# Altium project High power brushded DC MC.PrjPcb
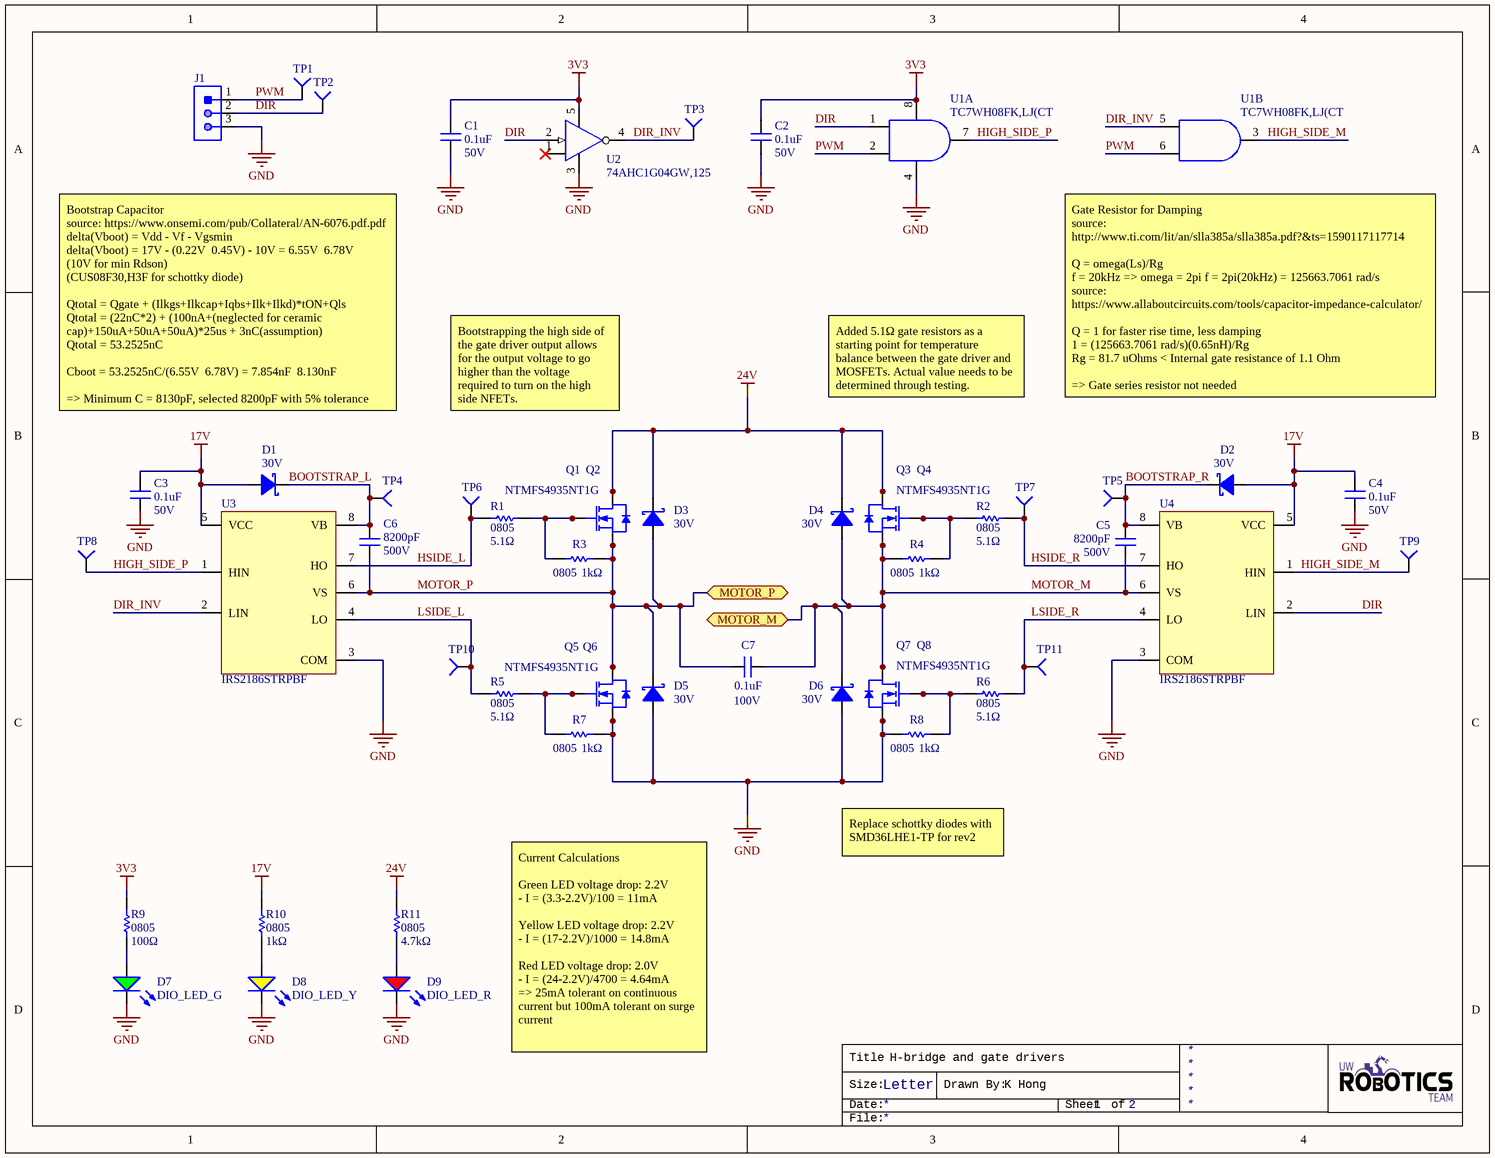
[diagram p0: H-bridge and gate drivers.SchDoc]
2 sheets, 81 parts. Net scope: flat (ports and power ports of the same name join across sheets).
Board file: High power brushded DC MC.PcbDoc
Sheets:
  H-bridge and gate drivers.SchDoc
  Connectors and PDB.SchDoc

## Sheet H-bridge and gate drivers.SchDoc: H-bridge and gate drivers
size Letter; DrawnBy: K Hong; SheetNumber: 1; SheetTotal: 2

### Parts
C1  value 0.1uF  Voltage Rating: 50V  [CAPC2012X140N]  (hidden comment: CAP_0.1uF_50V_0805)
C2  value 0.1uF  Voltage Rating: 50V  [CAPC2012X140N]  (hidden comment: CAP_0.1uF_50V_0805)
C3  value 0.1uF  Voltage Rating: 50V  [CAPC2012X140N]  (hidden comment: CAP_0.1uF_50V_0805)
C4  value 0.1uF  Voltage Rating: 50V  [CAPC2012X140N]  (hidden comment: CAP_0.1uF_50V_0805)
C5  Capacitance: 8200pF  Voltage Rating (DC): 500V  [CAPC1206(3216)]  (hidden comment: CAP_8200pF_500V_1206)
C6  Capacitance: 8200pF  Voltage Rating (DC): 500V  [CAPC1206(3216)]  (hidden comment: CAP_8200pF_500V_1206)
C7  Capacitance: 0.1uF  Voltage(DC): 100V  [MKS2D031001A00MSSD]  (hidden comment: CAP_0.1uF_100V_FILM)
D1  Vr (Max): 30V  [SOD-323_UNIDIR]  (hidden comment: DIO_SCHOTTKY_30V_800mA)
D2  Vr (Max): 30V  [SOD-323_UNIDIR]  (hidden comment: DIO_SCHOTTKY_30V_800mA)
D3  Vr (Max): 30V  [SOD-323_UNIDIR]  (hidden comment: DIO_SCHOTTKY_30V_800mA)
D4  Vr (Max): 30V  [SOD-323_UNIDIR]  (hidden comment: DIO_SCHOTTKY_30V_800mA)
D5  Vr (Max): 30V  [SOD-323_UNIDIR]  (hidden comment: DIO_SCHOTTKY_30V_800mA)
D6  Vr (Max): 30V  [SOD-323_UNIDIR]  (hidden comment: DIO_SCHOTTKY_30V_800mA)
D7  DIO_LED_G  [LED_0805_LINE]
D8  DIO_LED_Y  [LED_0805_LINE]
D9  DIO_LED_R  [LED_0805_LINE]
J1  CON_3M_TERM  [1935174]  (value not drawn)
Q1  NTMFS4935NT1G  [SO8-FL]  (value not drawn)
Q2  NTMFS4935NT1G  [SO8-FL]
Q3  NTMFS4935NT1G  [SO8-FL]
Q4  NTMFS4935NT1G  [SO8-FL]  (value not drawn)
Q5  NTMFS4935NT1G  [SO8-FL]  (value not drawn)
Q6  NTMFS4935NT1G  [SO8-FL]
Q7  NTMFS4935NT1G  [SO8-FL]  (value not drawn)
Q8  NTMFS4935NT1G  [SO8-FL]
R1  value 5.1Ω  Case Code (Imperial): 0805  [RESC2013X70X40LL20T20]  (hidden comment: RES_5.1Ω_0805)
R2  value 5.1Ω  Case Code (Imperial): 0805  [RESC2013X70X40LL20T20]  (hidden comment: RES_5.1Ω_0805)
R3  value 1kΩ  Case Code (Imperial): 0805  [RESC2012X60N]  (hidden comment: RES_1kΩ_0805)
R4  value 1kΩ  Case Code (Imperial): 0805  [RESC2012X60N]  (hidden comment: RES_1kΩ_0805)
R5  value 5.1Ω  Case Code (Imperial): 0805  [RESC2013X70X40LL20T20]  (hidden comment: RES_5.1Ω_0805)
R6  value 5.1Ω  Case Code (Imperial): 0805  [RESC2013X70X40LL20T20]  (hidden comment: RES_5.1Ω_0805)
R7  value 1kΩ  Case Code (Imperial): 0805  [RESC2012X60N]  (hidden comment: RES_1kΩ_0805)
R8  value 1kΩ  Case Code (Imperial): 0805  [RESC2012X60N]  (hidden comment: RES_1kΩ_0805)
R9  value 100Ω  Case Code (Imperial): 0805  [RESC2012X60N]  (hidden comment: RES_100Ω_0805)
R10  value 1kΩ  Case Code (Imperial): 0805  [RESC2012X60N]  (hidden comment: RES_1kΩ_0805)
R11  value 4.7kΩ  Case Code (Imperial): 0805  [RESC2012X60N]  (hidden comment: RES_4.7kΩ_0805)
TP1  TESTPOINT_SMD  [TESTPOINT]  (value not drawn)
TP2  TESTPOINT_SMD  [TESTPOINT]  (value not drawn)
TP3  TESTPOINT_SMD  [TESTPOINT]  (value not drawn)
TP4  TESTPOINT_SMD  [TESTPOINT]  (value not drawn)
TP5  TESTPOINT_SMD  [TESTPOINT]  (value not drawn)
TP6  TESTPOINT_SMD  [TESTPOINT]  (value not drawn)
TP7  TESTPOINT_SMD  [TESTPOINT]  (value not drawn)
TP8  TESTPOINT_SMD  [TESTPOINT]  (value not drawn)
TP9  TESTPOINT_SMD  [TESTPOINT]  (value not drawn)
TP10  TESTPOINT_SMD  [TESTPOINT]  (value not drawn)
TP11  TESTPOINT_SMD  [TESTPOINT]  (value not drawn)
U1  TC7WH08FK,LJ(CT  [8-VFSOP]  (parts A,B of 2)
U2  74AHC1G04GW,125  [SOT353]
U3  IRS2186STRPBF  [8-SOIC_M]
U4  IRS2186STRPBF  [8-SOIC_M]

### Ports
MOTOR_M (bidir), MOTOR_P (bidir)

### Nets
3V3: C1.2 C2.2 R9.2 U1.8(Vcc) U2.5(Vcc)
17V: C3.2 C4.2 D1.1(Anode) D2.1(Anode) R10.2 U3.5(VCC) U4.5(VCC)
24V: D3.2(Cathode) D4.2(Cathode) Q1.3(Drain) Q2.3(Drain) Q3.3(Drain) Q4.3(Drain) R11.2
GND: C1.1 C2.1 C3.1 C4.1 D5.1(Anode) D6.1(Anode) D7.2(K) D8.2(K) D9.2(K) J1.3 Q5.1(Source) Q6.1(Source) Q7.1(Source) Q8.1(Source) R7.2 R8.1 U1.4(GND) U2.3(GND) U3.3(COM) U4.3(COM)
BOOTSTRAP_L: C6.2 D1.2(Cathode) TP4.1(=value) U3.8(VB)
BOOTSTRAP_R: C5.2 D2.2(Cathode) TP5.1(=value) U4.8(VB)
DIR: J1.2 TP2.1(=value) U1.1(A1) U2.2(A) U4.2(LIN)
DIR_INV: TP3.1(=value) U1.5(A2) U2.4(Y) U3.2(LIN)
HIGH_SIDE_M: TP9.1(=value) U1.3(Y2) U4.1(HIN)
HIGH_SIDE_P: TP8.1(=value) U1.7(Y1) U3.1(HIN)
HSIDE_L: R1.1 TP6.1(=value) U3.7(HO)
HSIDE_R: R2.2 TP7.1(=value) U4.7(HO)
LSIDE_L: R5.1 TP10.1(=value) U3.4(LO)
LSIDE_R: R6.2 TP11.1(=value) U4.4(LO)
MOTOR_M: C5.1 C7.2 D4.1(Anode) D6.2(Cathode) Q3.1(Source) Q4.1(Source) Q7.3(Drain) Q8.3(Drain) R4.1 U4.6(VS) ; port MOTOR_M
MOTOR_P: C6.1 C7.1 D3.1(Anode) D5.2(Cathode) Q1.1(Source) Q2.1(Source) Q5.3(Drain) Q6.3(Drain) R3.2 U3.6(VS) ; port MOTOR_P
PWM: J1.1 TP1.1(=value) U1.2(B1) U1.6(B2)
NetD7_1: D7.1(A) R9.1
NetD8_1: D8.1(A) R10.1
NetD9_1: D9.1(A) R11.1
NetQ1_2: Q1.2(Gate) Q2.2(Gate) R1.2 R3.1
NetQ3_2: Q3.2(Gate) Q4.2(Gate) R2.1 R4.2
NetQ5_2: Q5.2(Gate) Q6.2(Gate) R5.2 R7.1
NetQ7_2: Q7.2(Gate) Q8.2(Gate) R6.1 R8.2

Not connected (* = marked no-connect by the designer): U2 1(NC)*

### Notes on the sheet
- Bootstrap Capacitor
  source: https://www.onsemi.com/pub/Collateral/AN-6076.pdf.pdf
  delta(Vboot) = Vdd - Vf - Vgsmin
  delta(Vboot) = 17V - (0.22V  0.45V) - 10V = 6.55V  6.78V
  (10V for min Rdson)
  (CUS08F30,H3F for schottky diode)
  Qtotal = Qgate + (Ilkgs+Ilkcap+Iqbs+Ilk+Ilkd)*tON+Qls
  Qtotal = (22nC*2) + (100nA+(neglected for ceramic cap)+150uA+50uA+50uA)*25us + 3nC(assumption)
  Qtotal = 53.2525nC
  Cboot = 53.2525nC/(6.55V  6.78V) = 7.854nF  8.130nF
  => Minimum C = 8130pF, selected 8200pF with 5% tolerance
- Bootstrapping the high side of the gate driver output allows for the output voltage to go higher than the voltage required to turn on the high side NFETs.
- Added 5.1Ω gate resistors as a starting point for temperature balance between the gate driver and MOSFETs. Actual value needs to be determined through testing.
- (near U1) Gate Resistor for Damping
  source: http://www.ti.com/lit/an/slla385a/slla385a.pdf?&ts=1590117117714
  Q = omega(Ls)/Rg
  f = 20kHz => omega = 2pi f = 2pi(20kHz) = 125663.7061 rad/s
  source: https://www.allaboutcircuits.com/tools/capacitor-impedance-calculator/
  Q = 1 for faster rise time, less damping
  1 = (125663.7061 rad/s)(0.65nH)/Rg
  Rg = 81.7 uOhms < Internal gate resistance of 1.1 Ohm
  => Gate series resistor not needed
- Replace schottky diodes with SMD36LHE1-TP for rev2
- Current Calculations
  Green LED voltage drop: 2.2V
  - I = (3.3-2.2V)/100 = 11mA
  Yellow LED voltage drop: 2.2V
  - I = (17-2.2V)/1000 = 14.8mA
  Red LED voltage drop: 2.0V
  - I = (24-2.2V)/4700 = 4.64mA
  => 25mA tolerant on continuous current but 100mA tolerant on surge current
- Title
- Size:
- Date:
- Letter
- Drawn By:
- Sheet
- of
- File:

### Library data of the parts
C1-C4 = CAP_0.1uF_50V_0805: CAP CER 0.1UF 50V X7R 0805; Manufacturer 1: Murata Electronics; Manufacturer Part Number 1: GCD21BR71H104KA01L; Capacitance: 100nF; Tolerance: 10%; Mount: Surface Mount; Case/Package: 0805; Case Code (Metric): 2012; Case Code (Imperial): 0805; Min Operating Temperature: -55°C; Max Operating Temperature: 125°C; Dielectric: X7R; Termination: SMD/SMT; Length: 2mm; Height: 1.25mm; Width: 0.049inch; Thickness: 0.049inch; Depth: 1.25mm; Ratings: AEC-Q200; ComponentLink1URL: https://datasheet.ciiva.com/29537/c03e-29537701.pdf?src-supplier=Digi-Key; ComponentLink1Description: https://datasheet.ciiva.com/29537/c03e-29537701.pdf?src-supplier=Digi-Key; Supplier 1: Digi-Key; Supplier Part Number 1: 490-11955-1-ND
C5 C6 = CAP_8200pF_500V_1206: Cap 0.0082uF 500Vdc C0G 5% SMD 1206 125°C Paper T/R; Manufacturer 1: KEMET; Manufacturer Part Number 1: C1206C822JCGACAUTO; Supplier 1: Digi-Key; RoHS: No; Category: Ceramic Capacitors; Stock 1: 2611; Pricing 1: 1=0.45000, 10=0.31800, 100=0.20960, 500=0.15528, 1000=0.13198 (USD); Tolerance: 5%; ComponentLink1URL: https://datasheet.ciiva.com:443/pdfs/VipMasterIC/IC/KEME/KEME-S-A0008958438/KEME-S-A0008958438-1.pdf?src-supplier=IHS+Markit; ComponentLink1Description: https://datasheet.ciiva.com:443/pdfs/VipMasterIC/IC/KEME/KEME-S-A0008958438/KEME-S-A0008958438-1.pdf?src-supplier=IHS+Markit; Supplier Part Number 1: 399-14847-1-ND; ComponentLink2URL: http://www.farnell.com/datasheets/2746514.pdf?src-supplier=Farnell; ComponentLink2Description: http://www.farnell.com/datasheets/2746514.pdf?src-supplier=Farnell; ComponentLink3URL: http://www.farnell.com/datasheets/2746514.pdf?src-supplier=Newark; ComponentLink3Description: http://www.farnell.com/datasheets/2746514.pdf?src-supplier=Newark; Package: 1206
C7 = CAP_0.1uF_100V_FILM: CAP FILM 0.1UF 100V RADIAL; Manufacturer 1: WIMA; Tolerance: 20%; Dielectric: PET; Lead Diameter: 0.5mm; Voltage(AC): 63V; Case/Package: Radial; Min Operating Temperature: -55°C; Max Operating Temperature: 100°C; Length: 7.2mm; Depth: 2.5mm; ComponentLink1URL: https://datasheet.ciiva.com:443/pdfs/VipMasterIC/IC/WIMA/WIMA-S-A0007419204/WIMA-S-A0007419204-1.pdf?src-supplier=IHS+Markit; ComponentLink1Description: https://datasheet.ciiva.com:443/pdfs/VipMasterIC/IC/WIMA/WIMA-S-A0007419204/WIMA-S-A0007419204-1.pdf?src-supplier=IHS+Markit; Supplier 1: Digi-Key; Supplier Part Number 1: 1928-1656-ND; Manufacturer Part Number 1: MKS2D031001A00MSSD; RoHS: Yes; Category: Film Capacitors; Stock 1: 4135; Pricing 1: 1=0.43000, 10=0.30000, 100=0.17970, 500=0.13478, 1000=0.11381, 2500=0.10782, 5000=0.10183 (USD); Packaging: Bulk; Lead Pitch: 5mm; Radiation Hardening: No; ComponentLink2URL: https://datasheet.ciiva.com/26863/getdatasheetpartid-403283-26863662.pdf?src-supplier=Verical; ComponentLink2Description: https://datasheet.ciiva.com/26863/getdatasheetpartid-403283-26863662.pdf?src-supplier=Verical
D1-D6 = DIO_SCHOTTKY_30V_800mA: DIODE SCHOTTKY 30V 800MA USC; Manufacturer 1: Toshiba Semiconductor and Storage; Manufacturer Part Number 1: CUS08F30,H3F; Vf (Max): 220mV; Supplier 1: Digi-Key; Supplier Part Number 1: CUS08F30H3FCT-ND; Mount: Surface Mount; Io: 800mA
D7 = DIO_LED_G: LED GREEN DIFFUSED 0805 SMD; Manufacturer Part Number 1: LG R971-KN-1; Manufacturer 1: OSRAM; Forward Voltage Drop: 2.2V; Package: 0805 (2012 Metric); Supplier Part Number 1: 475-1410-1-ND; Supplier 1: Digi-Key; Mount: Surface Mount
D8 = DIO_LED_Y: LED YELLOW DIFFUSED 0805 SMD; Manufacturer Part Number 1: LY R976-PS-36; Manufacturer 1: OSRAM; Forward Voltage Drop: 2.2V; Package: 0805 (2012 Metric); Supplier Part Number 1: 475-2560-1-ND; Supplier 1: Digi-Key; Mount: Surface Mount
D9 = DIO_LED_R: LED RED DIFFUSED 0805 SMD; Manufacturer Part Number 1: LS R976-NR-1; Manufacturer 1: OSRAM; Forward Voltage Drop: 2V; Package: 0805 (2012 Metric); Supplier Part Number 1: 475-1278-1-ND; Supplier 1: Digi-Key; Mount: Surface Mount
J1 = CON_3M_TERM: TERM BLK 3POS SIDE ENTRY 5MM; Manufacturer 1: Phoenix Contact; Number of Contacts: 3; Voltage Rating (DC): 320V; Number of Levels: 1; Current: 18A; Voltage: 300V; Max Current Rating: 16A; Voltage Rating: 250V; Current Rating: 17.5A; Wire Gauge (Max): 26AWG; Wire Gauge (Min): 12AWG; Approvals: UL,VDE,CB; Supplier 1: Digi-Key; Supplier Part Number 1: 277-1578-ND; Manufacturer Part Number 1: 1935174; Mount: Through Hole; RoHS: Yes; Category: Terminal Blocks; Stock 1: 25144; Pricing 1: 1=0.60000, 10=0.58000, 50=0.55440, 100=0.53930, 250=0.50400, 500=0.46368, 1000=0.42840, 2500=0.42838 (USD); Number of Pins: 3; Weight: 0.100531oz; Contact Material: Copper,Tin; Color: Green; Insulation Material: Nylon; Housing Material: Polyamide; Material: Nylon; Housing Color: Green; Termination: Solder; Packaging: Bulk; Orientation: Straight; Number of Positions Per Level: 3; Number of Positions: 3; Number of Circuits: 3; Package Quantity: 250; Number of Poles: 3; Number of Rows: 1; Max Supply Voltage: 250V; Length: 9mm; Height: 11.3mm; Pitch: 5mm; Depth: 9mm; Stripping Length: 5mm; Width: 15mm; Wire/Cable Gauge: 26AWG; Radiation Hardening: No; REACH SVHC: Unknown; Flammability Rating: UL94 V-0; Lead Free: Lead Free; ComponentLink1URL: https://datasheet.ciiva.com:443/pdfs/VipMasterIC/IC/PCON/PCON-S-A0007661889/PCON-S-A0008047997-1.pdf?src-supplier=IHS+Markit; ComponentLink1Description: https://datasheet.ciiva.com:443/pdfs/VipMasterIC/IC/PCON/PCON-S-A0007661889/PCON-S-A0008047997-1.pdf?src-supplier=IHS+Markit; ComponentLink2URL: https://datasheet.ciiva.com/16047/1935174-16047249.pdf?src-supplier=Onlinecomponents.com; ComponentLink2Description: https://datasheet.ciiva.com/16047/1935174-16047249.pdf?src-supplier=Onlinecomponents.com; ComponentLink3URL: https://datasheet.ciiva.com/15169/getdatasheetpartid-212213-15169949.pdf?src-supplier=Verical; ComponentLink3Description: https://datasheet.ciiva.com/15169/getdatasheetpartid-212213-15169949.pdf?src-supplier=Verical; ComponentLink4URL: https://datasheet.ciiva.com/823/combiconcompact5-0mmseries-823761.pdf?src-supplier=Digi-Key; ComponentLink4Description: https://datasheet.ciiva.com/823/combiconcompact5-0mmseries-823761.pdf?src-supplier=Digi-Key; ComponentLink5URL: https://datasheet.ciiva.com/29218/744167-da-01-en-printklemme-pt-1-5-3-5-0-h-29218252.pdf?src-supplier=Conrad; ComponentLink5Description: https://datasheet.ciiva.com/29218/744167-da-01-en-printklemme-pt-1-5-3-5-0-h-29218252.pdf?src-supplier=Conrad
Q1-Q8 = NTMFS4935NT1G: MOSFET N-CH 30V 13A SO8FL; Manufacturer 1: ON Semiconductor; Continuous Drain Current (ID): 93A; Drain to Source Resistance: 3.2mR; Power Dissipation: 2.63W; Max Power Dissipation: 48W; Threshold Voltage: 1.63V; Turn-On Delay Time: 16.3ns; Turn-Off Delay Time: 27.5ns; Fall Time: 6.6ns; Number of Elements: 1; Input Capacitance: 4.85nF; Rise Time: 20ns; Element Configuration: Single; Gate to Source Voltage (Vgs): 20V; Supplier 1: Digi-Key; RoHS: Yes; Category: MOSFETs; Stock 1: 10192; Pricing 1: 1=0.87000, 10=0.76800, 25=0.72160, 100=0.52380, 250=0.50516, 500=0.43766 (USD); Case/Package: SO; Number of Pins: 5; Contact Plating: Tin,Matte; Min Operating Temperature: -55°C; Max Operating Temperature: 150°C; Drain to Source Breakdown Voltage: 30V; Drain to Source Voltage (Vdss): 30V; Nominal Vgs: 1.63V; Package Quantity: 1; Rds On Max: 3.2mR; Packaging: Tape and Reel; Length: 5.1mm; Height: 1.1mm; Width: 6.1mm; Radiation Hardening: No; Lead Free: Lead Free; REACH SVHC: No SVHC; ComponentLink1URL: https://datasheet.ciiva.com:443/pdfs/VipMasterIC/IC/ONSM/ONSM-S-A0008367025/ONSM-S-A0008367025-1.pdf?src-supplier=IHS+Markit; ComponentLink1Description: https://datasheet.ciiva.com:443/pdfs/VipMasterIC/IC/ONSM/ONSM-S-A0008367025/ONSM-S-A0008367025-1.pdf?src-supplier=IHS+Markit; ComponentLink2URL: https://datasheet.ciiva.com/22641/1707323-22641681.pdf?src-supplier=Element14; ComponentLink2Description: https://datasheet.ciiva.com/22641/1707323-22641681.pdf?src-supplier=Element14; ComponentLink3URL: https://datasheet.ciiva.com/947/ntmfs4935n-d-947308.pdf?src-supplier=Digi-Key; ComponentLink3Description: https://datasheet.ciiva.com/947/ntmfs4935n-d-947308.pdf?src-supplier=Digi-Key; ComponentLink4URL: https://datasheet.ciiva.com/11166/ntmfs4935n-d-11166461.pdf?src-supplier=Avnet; ComponentLink4Description: https://datasheet.ciiva.com/11166/ntmfs4935n-d-11166461.pdf?src-supplier=Avnet; ComponentLink5URL: https://datasheet.ciiva.com/947/ntmfs4935n-d-947310.pdf?src-supplier=Digi-Key; ComponentLink5Description: https://datasheet.ciiva.com/947/ntmfs4935n-d-947310.pdf?src-supplier=Digi-Key; ComponentLink6URL: https://datasheet.ciiva.com/947/ntmfs4935n-d-947309.pdf?src-supplier=Digi-Key; ComponentLink6Description: https://datasheet.ciiva.com/947/ntmfs4935n-d-947309.pdf?src-supplier=Digi-Key; Supplier Part Number 1: NTMFS4935NT1GOSCT-ND
  Q2 Q3 Q6 Q8: Manufacturer Part Number 1: NTMFS4935NT1G
R1 R2 R5 R6 = RES_5.1Ω_0805: RES SMD 5.1 OHM 5% 1/8W 0805; Manufacturer 1: Panasonic; Manufacturer Part Number 1: ERJ-6GEYJ5R1V; Supplier 1: Digi-Key; Supplier Part Number 1: P5.1ACT-ND; Mount: Surface Mount; Case Code (Metric): 2012
R3 R4 R7 R8 R10 = RES_1kΩ_0805: RES SMD 1K OHM 1% 1/8W 0805; Manufacturer 1: Yageo; Manufacturer Part Number 1: RC0805FR-071KL; Power Rating: 125mW; Supplier 1: Digi-Key; Case Code (Metric): 2012; Min Operating Temperature: -55°C; Max Operating Temperature: 155°C; Resistance: 1K; Tolerance: 1%; Termination: SMD/SMT; Supplier Part Number 1: 311-1.00KCRCT-ND
R9 = RES_100Ω_0805: RES SMD 100 OHM 1% 1/8W 0805; Manufacturer 1: Yageo; Manufacturer Part Number 1: RC0805FR-07100RL; Power Rating: 125mW; Supplier 1: Digi-Key; Mount: Surface Mount; Case Code (Metric): 2012; Supplier Part Number 1: 311-100CRCT-ND
R11 = RES_4.7kΩ_0805: RES SMD 4.7K OHM 5% 1/8W 0805; Manufacturer 1: Yageo; Manufacturer Part Number 1: RC0805JR-074K7L; Resistance: 4.7kR; Power Rating: 125mW; Temperature Coefficient: 100ppm/°C; Voltage Rating: 150V; Supplier 1: Digi-Key; Case Code (Metric): 2012; Min Operating Temperature: -55°C; Max Operating Temperature: 155°C; Tolerance: 5%; Termination: SMD/SMT; Supplier Part Number 1: 311-4.7KARCT-ND; Stock 1: 2755291; Pricing 1: 1=0.10000, 10=0.03500, 100=0.01400, 1000=0.00631, 2500=0.00548 (USD); RoHS: Yes; Case/Package: Molded; Contact Plating: Tin,Lead,Matte; Packaging: Tape and Reel; Composition: Thick Film; Military Standard: Not; Length: 2mm; Depth: 1.25mm; Radiation Hardening: No; REACH SVHC: Unknown; Lead Free: Lead Free; ComponentLink1URL: https://datasheet.ciiva.com/7941/442941-7941973.pdf?src-supplier=Element14; ComponentLink1Description: https://datasheet.ciiva.com/7941/442941-7941973.pdf?src-supplier=Element14; ComponentLink2URL: https://datasheet.ciiva.com/7941/442941-7941974.pdf?src-supplier=Element14; ComponentLink2Description: https://datasheet.ciiva.com/7941/442941-7941974.pdf?src-supplier=Element14; ComponentLink3URL: https://datasheet.ciiva.com/17486/rc0805-17486827.pdf?src-supplier=Future+Electronics; ComponentLink3Description: https://datasheet.ciiva.com/17486/rc0805-17486827.pdf?src-supplier=Future+Electronics; ComponentLink4URL: https://datasheet.ciiva.com/12667/rc0805-12667037.pdf?src-supplier=Mouser; ComponentLink4Description: https://datasheet.ciiva.com/12667/rc0805-12667037.pdf?src-supplier=Mouser; Mount: Surface Mount
U1 = TC7WH08FK,LJ(CT: AND Gate 2-Element 2-IN CMOS Automotive 8-Pin SSOP T/R; Manufacturer 1: Toshiba; Number of Circuits: 2; Quiescent Current: 2uA; High Level Output Current: 8mA; Propagation Delay: 7.9ns; Supplier 1: Digi-Key; RoHS: Yes; Category: Logic Gates; Stock 1: 703; Pricing 1: 1=0.41000, 10=0.30500, 25=0.27520, 100=0.19000, 250=0.16000, 500=0.13000, 1000=0.10000 (USD); Mount: Surface Mount; Number of Pins: 8; Min Operating Temperature: -40°C; Max Operating Temperature: 85°C; Logic Function: AND; Packaging: Tape and Reel; Number of Inputs: 2; Low Level Output Current: 8mA; ComponentLink1URL: https://datasheet.ciiva.com:443/pdfs/VipMasterIC/IC/TOSC/TOSC-S-A0002811544/TOSC-S-A0002811544-1.pdf?src-supplier=IHS+Markit; ComponentLink1Description: https://datasheet.ciiva.com:443/pdfs/VipMasterIC/IC/TOSC/TOSC-S-A0002811544/TOSC-S-A0002811544-1.pdf?src-supplier=IHS+Markit; ComponentLink2URL: http://www.mouser.com/ds/2/408/TC7WH08FU_datasheet_en_20170424-1144181.pdf?src-supplier=Mouser; ComponentLink2Description: http://www.mouser.com/ds/2/408/TC7WH08FU_datasheet_en_20170424-1144181.pdf?src-supplier=Mouser; ComponentLink3URL: https://toshiba.semicon-storage.com/info/docget.jsp?did=20117&prodName=TC7WH08FU&src-supplier=Digi-Key; ComponentLink3Description: https://toshiba.semicon-storage.com/info/docget.jsp?did=20117&prodName=TC7WH08FU&src-supplier=Digi-Key; Supplier Part Number 1: TC7WH08FKLJ(CTCT-ND; Manufacturer Part Number 1: TC7WH08FK,LJ(CT
U2 = 74AHC1G04GW,125: 74AHC Series 5 V High Speed Si-Gate CMOS Inverter Buffer Surface Mount - TSSOP-5; Manufacturer 1: Nexperia; Supplier 1: Digi-Key; RoHS: No; Stock 1: 10022; Pricing 1: 1=0.21000, 10=0.17400, 25=0.14600, 100=0.09230, 250=0.07128, 500=0.06076, 1000=0.04131 (USD); ComponentLink1URL: https://datasheet.ciiva.com:443/pdfs/VipMasterIC/IC/NEXP/NEXP-S-A0003105567/NEXP-S-A0003105477-1.pdf?src-supplier=IHS+Markit; ComponentLink1Description: https://datasheet.ciiva.com:443/pdfs/VipMasterIC/IC/NEXP/NEXP-S-A0003105567/NEXP-S-A0003105477-1.pdf?src-supplier=IHS+Markit; Supplier Part Number 1: 1727-3147-1-ND; Manufacturer Part Number 1: 74AHC1G04GW,125
U3 U4 = IRS2186STRPBF: IC DRIVER HI/LO SIDE 600V 8-SOIC; Manufacturer 1: International Rectifier; Max Supply Current: 240uA; Number of Outputs: 2; Max Supply Voltage: 20V; Min Supply Voltage: 10V; Max Power Dissipation: 625mW; Fall Time: 30ns; Turn-Off Delay Time: 170ns; Rise Time: 38ns; Propagation Delay: 250ns; Max Output Current: 4A; Supplier 1: Digi-Key; RoHS: Yes; Category: Gate Drivers; Stock 1: 2450; Pricing 1: 1=1.50000, 10=1.35000, 25=1.27400, 100=1.01920, 250=0.89180, 500=0.86632, 1000=0.68796 (USD); Mount: Surface Mount; Case/Package: SOIC; Number of Pins: 8; Min Operating Temperature: -40°C; Max Operating Temperature: 125°C; Number of Drivers: 2; Turn-On Delay Time: 170ns; Power Dissipation: 625mW; Package Quantity: 1; Packaging: Tape and Reel; Output Current: 4A; Nominal Supply Current: 240uA; Radiation Hardening: No; Lead Free: Lead Free; ComponentLink1URL: https://datasheet.ciiva.com:443/pdfs/VipMasterIC/IC/IRSD/IRSD-S-A0000774532/IRSD-S-A0000774532-1.pdf?src-supplier=IHS+Markit; ComponentLink1Description: https://datasheet.ciiva.com:443/pdfs/VipMasterIC/IC/IRSD/IRSD-S-A0000774532/IRSD-S-A0000774532-1.pdf?src-supplier=IHS+Markit; ComponentLink2URL: https://datasheet.ciiva.com/1952/irs2186pbf-1952608.pdf?src-supplier=Digi-Key; ComponentLink2Description: https://datasheet.ciiva.com/1952/irs2186pbf-1952608.pdf?src-supplier=Digi-Key; ComponentLink3URL: https://datasheet.ciiva.com/16442/irs2186pbf-16442422.pdf?src-supplier=Future+Electronics; ComponentLink3Description: https://datasheet.ciiva.com/16442/irs2186pbf-16442422.pdf?src-supplier=Future+Electronics; ComponentLink4URL: https://datasheet.ciiva.com/1952/irs2186pbf-1952607.pdf?src-supplier=Digi-Key; ComponentLink4Description: https://datasheet.ciiva.com/1952/irs2186pbf-1952607.pdf?src-supplier=Digi-Key; Supplier Part Number 1: IRS2186STRPBFCT-ND; Manufacturer Part Number 1: IRS2186STRPBF
TP1-TP11 = TESTPOINT_SMD: Part Number (MPN): *

## Sheet Connectors and PDB.SchDoc: Connectors and PDB
size Letter; DrawnBy: Kyle Hong; SheetNumber: 2; SheetTotal: 2
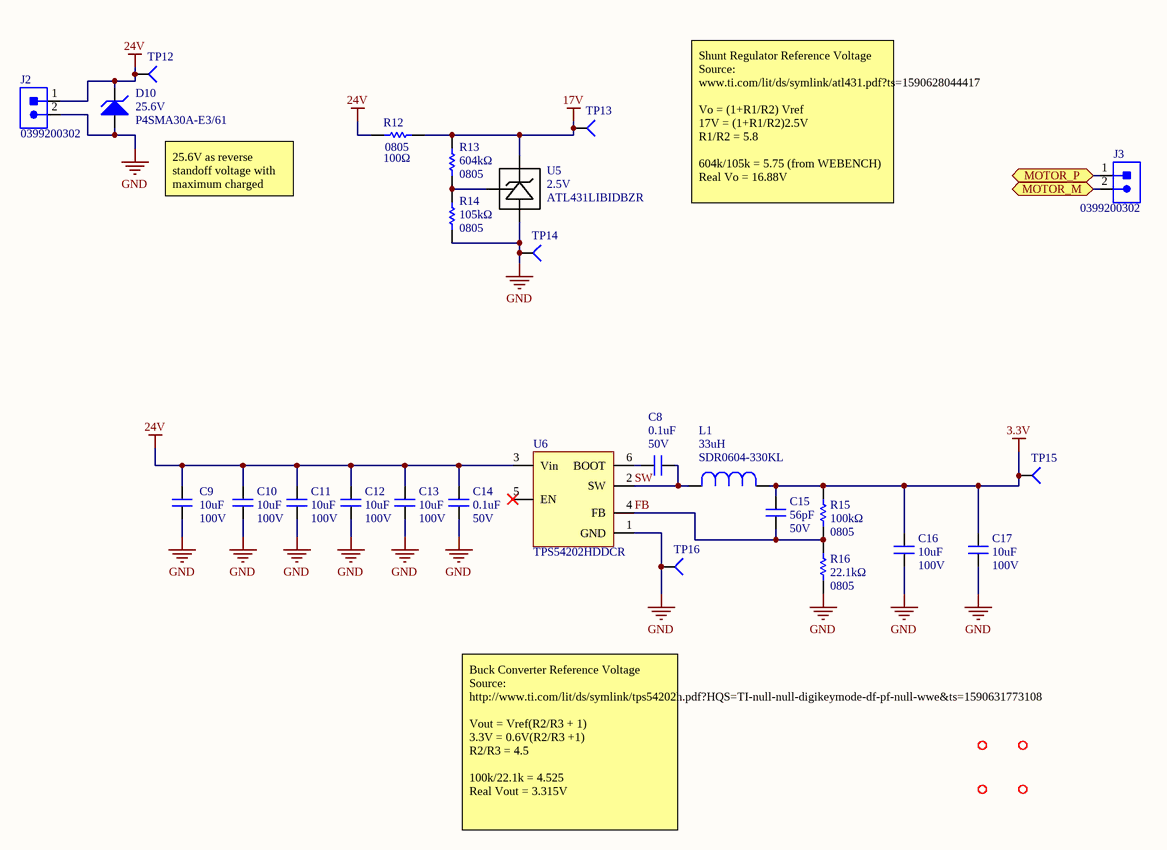
[diagram p1: Connectors and PDB.SchDoc]

### Parts
C8  value 0.1uF  Voltage Rating: 50V  [CAPC2012X140N]  (hidden comment: CAP_0.1uF_50V_0805)
C9  Capacitance: 10uF  Voltage Rating: 100V  [CAPC1210(3225)]  (hidden comment: CAP_10uF_100V_1210)
C10  Capacitance: 10uF  Voltage Rating: 100V  [CAPC1210(3225)]  (hidden comment: CAP_10uF_100V_1210)
C11  Capacitance: 10uF  Voltage Rating: 100V  [CAPC1210(3225)]  (hidden comment: CAP_10uF_100V_1210)
C12  Voltage Rating: 100V  Capacitance: 10uF  [CAPC1210(3225)]  (hidden comment: CAP_10uF_100V_1210)
C13  Voltage Rating: 100V  Capacitance: 10uF  [CAPC1210(3225)]  (hidden comment: CAP_10uF_100V_1210)
C14  value 0.1uF  Voltage Rating: 50V  [CAPC2012X140N]  (hidden comment: CAP_0.1uF_50V_0805)
C15  Voltage Rating: 50V  Capacitance: 56pF  [CAP 0805_2012]  (hidden comment: CAP_56pF_50V_0805)
C16  Capacitance: 10uF  Voltage Rating: 100V  [CAPC1210(3225)]  (hidden comment: CAP_10uF_100V_1210)
C17  Capacitance: 10uF  Voltage Rating: 100V  [CAPC1210(3225)]  (hidden comment: CAP_10uF_100V_1210)
D10  Reverse Standoff Voltage: 25.6V  [DO-214AC_UNI]  (hidden comment: P4SMA30A-E3/61)
J2  Manufacturer Part Number 1: 0399200302  [MOLEX-0399200302]  (hidden comment: SCREW_TERM_115A)
J3  Manufacturer Part Number 1: 0399200302  [MOLEX-0399200302]  (hidden comment: SCREW_TERM_115A)
L1  Manufacturer Part Number 1: SDR0604-330KL  Inductance: 33uH  [IND_BOURNS_SDR0604]  (hidden comment: IND_33uH_880mA)
MH1  MOUNTING_HOLES  [MOUNTING_HOLE]  (value not drawn)
MH2  MOUNTING_HOLES  [MOUNTING_HOLE]  (value not drawn)
MH3  MOUNTING_HOLES  [MOUNTING_HOLE]  (value not drawn)
MH4  MOUNTING_HOLES  [MOUNTING_HOLE]  (value not drawn)
R12  value 100Ω  Case Code (Imperial): 0805  [RESC2012X60N]  (hidden comment: RES_100Ω_0805)
R13  Resistance: 604kΩ  Case/Package: 0805  [RESC2012X60N]  (hidden comment: RES_604kΩ_0805)
R14  Resistance: 105kΩ  Case Code (Imperial): 0805  [RESC2012X60N]  (hidden comment: RES_105kΩ_0805)
R15  Resistance: 100kΩ  Case/Package: 0805  [RESC2012X60N]  (hidden comment: RES_100kΩ_0805)
R16  Case Code (Imperial): 0805  Resistance: 22.1kΩ  [RESC2012X60N]  (hidden comment: RES_22.1kΩ_0805)
TP12  TESTPOINT_SMD  [TESTPOINT]  (value not drawn)
TP13  TESTPOINT_SMD  [TESTPOINT]  (value not drawn)
TP14  TESTPOINT_SMD  [TESTPOINT]  (value not drawn)
TP15  TESTPOINT_SMD  [TESTPOINT]  (value not drawn)
TP16  TESTPOINT_SMD  [TESTPOINT]  (value not drawn)
U5  Reference Voltage: 2.5V  [SOT23-3]  (hidden comment: ATL431LIBIDBZR)
U6  TPS54202HDDCR  [SOT23-6]

### Ports
MOTOR_M (bidir), MOTOR_P (bidir)

### Nets
3.3V: C15.2 C16.2 C17.2 L1.1 R15.2 TP15.1(=value)
17V: R12.2 R13.2 TP13.1(=value) U5.1(CATHODE)
24V: C9.2 C10.2 C11.2 C12.2 C13.2 C14.2 D10.2 J2.1 R12.1 TP12.1(=value) U6.3(Vin)
GND: C9.1 C10.1 C11.1 C12.1 C13.1 C14.1 C16.1 C17.1 D10.1 J2.2 R14.1 R16.1 TP14.1(=value) TP16.1(=value) U5.3(ANODE) U6.1(GND)
FB: C15.1 R15.1 R16.2 U6.4(FB)
MOTOR_M: J3.2 ; port MOTOR_M
MOTOR_P: J3.1 ; port MOTOR_P
SW: C8.2 L1.2 U6.2(SW)
NetC8_1: C8.1 U6.6(BOOT)
NetR13_1: R13.1 R14.2 U5.2(REF)

Not connected (* = marked no-connect by the designer): U6 5(EN)*

### Notes on the sheet
- 25.6V as reverse standoff voltage with maximum charged condition in mind
- Shunt Regulator Reference Voltage
  Source: www.ti.com/lit/ds/symlink/atl431.pdf?ts=1590628044417
  Vo = (1+R1/R2) Vref
  17V = (1+R1/R2)2.5V
  R1/R2 = 5.8
  604k/105k = 5.75 (from WEBENCH)
  Real Vo = 16.88V
- Buck Converter Reference Voltage
  Source: http://www.ti.com/lit/ds/symlink/tps54202h.pdf?HQS=TI-null-null-digikeymode-df-pf-null-wwe&ts=1590631773108
  Vout = Vref(R2/R3 + 1)
  3.3V = 0.6V(R2/R3 +1)
  R2/R3 = 4.5
  100k/22.1k = 4.525
  Real Vout = 3.315V
- Title
- Size:
- Date:
- Letter
- Drawn By:
- Sheet
- of
- File:

### Library data of the parts
C8 C14 = CAP_0.1uF_50V_0805: as C1 on sheet H-bridge and gate drivers; Mount: Surface Mount; Case/Package: 0805; Case Code (Metric): 2012; Case Code (Imperial): 0805; Min Operating Temperature: -55°C; Max Operating Temperature: 125°C; Dielectric: X7R; Termination: SMD/SMT; Length: 2mm; Height: 1.25mm; Width: 0.049inch; Thickness: 0.049inch; Depth: 1.25mm; Ratings: AEC-Q200; ComponentLink1URL: https://datasheet.ciiva.com/29537/c03e-29537701.pdf?src-supplier=Digi-Key; ComponentLink1Description: https://datasheet.ciiva.com/29537/c03e-29537701.pdf?src-supplier=Digi-Key; Supplier 1: Digi-Key; Supplier Part Number 1: 490-11955-1-ND
C9-C13 C16 C17 = CAP_10uF_100V_1210: CAP CER 10uF 100V X7S 10% 1210; Manufacturer 1: Murata; Manufacturer Part Number 1: GRM32EC72A106KE05L; Supplier 1: Digi-Key; RoHS: No; Category: Ceramic Capacitors; Stock 1: 5650; Pricing 1: 1=1.51000, 10=1.19500, 100=0.89660, 500=0.67740 (USD); Mount: Surface Mount; Case/Package: 1210; Case Code (Imperial): 1210; Case Code (Metric): 3225; Min Operating Temperature: -55°C; Max Operating Temperature: 125°C; Packaging: Tape and Reel; Tolerance: 10%; ComponentLink1URL: https://psearch.en.murata.com:443/capacitor/product/GRM32EC72A106KE05%23.pdf?src-supplier=IHS+Markit; ComponentLink1Description: https://psearch.en.murata.com:443/capacitor/product/GRM32EC72A106KE05%23.pdf?src-supplier=IHS+Markit; ComponentLink2URL: http://search.murata.co.jp/Ceramy/image/img/A01X/G101/ENG/GRM32EC72A106KE05-01.pdf?src-supplier=Digi-Key; ComponentLink2Description: http://search.murata.co.jp/Ceramy/image/img/A01X/G101/ENG/GRM32EC72A106KE05-01.pdf?src-supplier=Digi-Key; Supplier Part Number 1: 490-16266-1-ND
C15 = CAP_56pF_50V_0805: CAP CER 56PF 50V C0G/NP0; Manufacturer 1: Yageo; Manufacturer Part Number 1: CC0805FRNPO9BN560; Dielectric: C0G; Tolerance: 1%; Supplier 1: Digi-Key; RoHS: Yes; Category: Ceramic Capacitors; Stock 1: 3302; Pricing 1: 1=0.28000, 10=0.19000, 100=0.10740, 500=0.07582, 1000=0.06634 (USD); Mount: Surface Mount; Case/Package: 0805; Weight: 0.000194oz; Case Code (Metric): 2012; Case Code (Imperial): 0805; Min Operating Temperature: -55°C; Max Operating Temperature: 125°C; Termination: SMD/SMT; Composition: Ceramic; Packaging: Tape and Reel; Voltage Rating (DC): 50V; Length: 2mm; Height: 0.6mm; Depth: 1.25mm; Width: 0.049inch; Thickness: 0.028inch; Radiation Hardening: No; ComponentLink1URL: https://datasheet.ciiva.com:443/pdfs/VipMasterIC/IC/YAGO/YAGO-S-A0009251638/YAGO-S-A0009251638-1.pdf?src-supplier=IHS+Markit; ComponentLink1Description: https://datasheet.ciiva.com:443/pdfs/VipMasterIC/IC/YAGO/YAGO-S-A0009251638/YAGO-S-A0009251638-1.pdf?src-supplier=IHS+Markit; ComponentLink2URL: https://datasheet.ciiva.com/26918/getdatasheetpartid-251796-26918325.pdf?src-supplier=Verical; ComponentLink2Description: https://datasheet.ciiva.com/26918/getdatasheetpartid-251796-26918325.pdf?src-supplier=Verical; ComponentLink3URL: https://datasheet.ciiva.com/11465/upy-gp-np0-16v-to-50v-8-11465142.pdf?src-supplier=Avnet; ComponentLink3Description: https://datasheet.ciiva.com/11465/upy-gp-np0-16v-to-50v-8-11465142.pdf?src-supplier=Avnet; ComponentLink4URL: https://datasheet.ciiva.com/17436/upy-gp-np0-16v-to-50v-8-17436825.pdf?src-supplier=Avnet+Europe; ComponentLink4Description: https://datasheet.ciiva.com/17436/upy-gp-np0-16v-to-50v-8-17436825.pdf?src-supplier=Avnet+Europe; Supplier Part Number 1: 311-4179-1-ND
D10 = P4SMA30A-E3/61: TVS DIODE, 400W, 25.6V, UNI, DO-214AC; Manufacturer 1: Vishay Semiconductors; Element Configuration: Single; Leakage Current: 1uA; Direction: Unidirectional; Reverse Breakdown Voltage: 28.5V; Max Surge Current: 40A; Number of Unidirectional Channels: 1; Clamping Voltage: 41.4V; Power Line Protection: No; Test Current: 1mA; Peak Pulse Current: 9.7A; Supplier 1: Digi-Key; RoHS: Yes; Category: TVS Diodes; Stock 1: 1849; Pricing 1: 1=0.35000, 10=0.28400, 25=0.26000, 100=0.16340, 250=0.16152, 500=0.15126 (USD); Mount: Surface Mount; Case/Package: SMA; Number of Pins: 2; Min Operating Temperature: -65°C; Max Operating Temperature: 150°C; Max Power Dissipation: 400W; Composition: Zener; Packaging: Tape and Reel; Package Quantity: 1800; Operating Supply Voltage: 25.6V; Polarity: Unidirectional; Min Breakdown Voltage: 28.5V; Peak Pulse Power: 400W; Breakdown Voltage: 28.5V; Number of Channels: 1; Max Reverse Leakage Current: 1uA; Number of Elements: 1; ComponentLink1URL: https://datasheet.ciiva.com:443/pdfs/VipMasterIC/IC/VISH/VISH-S-A0008073361/VISH-S-A0008073361-1.pdf?src-supplier=IHS+Markit; ComponentLink1Description: https://datasheet.ciiva.com:443/pdfs/VipMasterIC/IC/VISH/VISH-S-A0008073361/VISH-S-A0008073361-1.pdf?src-supplier=IHS+Markit; ComponentLink2URL: https://datasheet.ciiva.com/343/p4sma-343073.pdf?src-supplier=Digi-Key; ComponentLink2Description: https://datasheet.ciiva.com/343/p4sma-343073.pdf?src-supplier=Digi-Key; Supplier Part Number 1: P4SMA30A-E3/61GICT-ND; Manufacturer Part Number 1: P4SMA30A-E3/61
J2 J3 = SCREW_TERM_115A: CONN TERM BLOCK 2POS 15MM 1-8AWG; Manufacturer 1: Molex; Plating: Brass,Bronze,Tin; Number of Levels: 1; Number of Positions Per Level: 2; Current: 115A; Voltage: 600V; Pitch: 0.591inch; Wire Gauge (Max): 8AWG; Wire Gauge (Min): 1AWG; Supplier 1: Digi-Key; Supplier Part Number 1: WM20114-ND; RoHS: Yes; Category: Terminal Blocks; Stock 2: 268; Pricing 2: 1=9.66000, 10=8.27400, 25=7.89600, 50=7.09800, 100=6.72000, 250=6.09000, 500=5.67000, 1000=5.35500, 5000=5.04000 (USD); Mount: Through Hole; Housing Material: Polybutylene; Contact Material: Copper; Color: Black; Contact Plating: Copper,Tin,Bright; Housing Color: Black; Min Operating Temperature: -40°C; Max Operating Temperature: 130°C; Termination: Solder; Packaging: Bulk; Number of Rows: 1; Orientation: Straight; Number of Circuits: 2; Number of Contacts: 2; Max Supply Voltage (AC): 600V; Max Voltage Rating (AC): 600V; Length: 32mm; Depth: 20.32mm; Radiation Hardening: No; ComponentLink1URL: https://datasheet.ciiva.com/6751/399200305-sd-6751818.pdf?src-supplier=Digi-Key; ComponentLink1Description: https://datasheet.ciiva.com/6751/399200305-sd-6751818.pdf?src-supplier=Digi-Key
L1 = IND_33uH_880mA: IND, 33uH, 10%, 1 Element, Ferrite-Core, SMD; Manufacturer 1: Bourns; Max DC Current: 880mA; DC Resistance (DCR): 250mR; Test Frequency: 1kHz; Q Factor: 24; Self Resonant Frequency: 13MHz; Saturation Current: 1.1A; Shielding: Unshielded; Supplier 1: Digi-Key; RoHS: Yes; Category: Fixed Inductors; Stock 1: 4659; Pricing 1: 1=0.60000, 10=0.52300, 100=0.37380 (USD); Mount: Surface Mount; Case/Package: Nonstandard; Number of Pins: 2; Core Material: Ferrite; Min Operating Temperature: -40°C; Max Operating Temperature: 125°C; Tolerance: 10%; Termination: SMD/SMT; Composition: Wirewound; RMS Current (Irms): 880mA; DC Current: 880mA; Military Standard: Not; Resistance: 250MR; Inductance Tolerance: 10%; Packaging: Tape and Reel; Package Quantity: 400; Current Rating: 880mA; Diameter: 5.8mm; Length: 0.228inch; Height: 4.8mm; Height - Seated (Max): 0.189inch; Width: 0.228inch; Radiation Hardening: No; REACH SVHC: No SVHC; ComponentLink1URL: https://datasheet.ciiva.com:443/pdfs/VipMasterIC/IC/BOUR/BOUR-S-A0006604757/BOUR-S-A0006604757-1.pdf?src-supplier=IHS+Markit; ComponentLink1Description: https://datasheet.ciiva.com:443/pdfs/VipMasterIC/IC/BOUR/BOUR-S-A0006604757/BOUR-S-A0006604757-1.pdf?src-supplier=IHS+Markit; ComponentLink2URL: https://datasheet.ciiva.com/11802/0900766b80f2b58d-11802553.pdf?src-supplier=RSComponents; ComponentLink2Description: https://datasheet.ciiva.com/11802/0900766b80f2b58d-11802553.pdf?src-supplier=RSComponents; ComponentLink3URL: https://datasheet.ciiva.com/8516/sdr0604-8516774.pdf?src-supplier=Avnet; ComponentLink3Description: https://datasheet.ciiva.com/8516/sdr0604-8516774.pdf?src-supplier=Avnet; ComponentLink4URL: https://datasheet.ciiva.com/22697/1635216-22697302.pdf?src-supplier=Element14; ComponentLink4Description: https://datasheet.ciiva.com/22697/1635216-22697302.pdf?src-supplier=Element14; ComponentLink5URL: https://datasheet.ciiva.com/6689/sdr0604-6689448.pdf?src-supplier=Digi-Key; ComponentLink5Description: https://datasheet.ciiva.com/6689/sdr0604-6689448.pdf?src-supplier=Digi-Key; ComponentLink6URL: https://datasheet.ciiva.com/7838/1635216-7838921.pdf?src-supplier=Element14; ComponentLink6Description: https://datasheet.ciiva.com/7838/1635216-7838921.pdf?src-supplier=Element14; ComponentLink7URL: https://datasheet.ciiva.com/6689/sdr0604-6689450.pdf?src-supplier=Digi-Key; ComponentLink7Description: https://datasheet.ciiva.com/6689/sdr0604-6689450.pdf?src-supplier=Digi-Key; ComponentLink8URL: https://datasheet.ciiva.com/8515/sdr0604-8515983.pdf?src-supplier=Avnet; ComponentLink8Description: https://datasheet.ciiva.com/8515/sdr0604-8515983.pdf?src-supplier=Avnet; Supplier Part Number 1: SDR0604-330KLCT-ND
MH1-MH4 = MOUNTING_HOLES: 6cm x 6cm
R12 = RES_100Ω_0805: as R9 on sheet H-bridge and gate drivers; Supplier 1: Digi-Key; Mount: Surface Mount; Case Code (Metric): 2012; Supplier Part Number 1: 311-100CRCT-ND
R13 = RES_604kΩ_0805: RES SMD 604K OHM 0.1% 1/4W 0805; Manufacturer 1: Panasonic; Manufacturer Part Number 1: ERJ-PB6B6043V; Max Power Dissipation: 250mW; Temperature Coefficient: 50ppm/°C; Supplier 1: Digi-Key; RoHS: Yes; Category: Chip SMD Resistors; Stock 1: 1993; Pricing 1: 1=0.36000, 10=0.30600, 25=0.22280, 50=0.16140, 100=0.11970, 250=0.09184, 500=0.07236, 1000=0.05009 (USD); Case Code (Imperial): 0805; Case Code (Metric): 2012; Min Operating Temperature: -55°C; Max Operating Temperature: 155°C; Features: Automotive AEC-Q200; Tolerance: 0.1%; Packaging: Tape and Reel; Composition: Thick Film; Number of Terminations: 2; Length: 0.079inch; Width: 0.049inch; Height - Seated (Max): 0.028inch; ComponentLink1URL: https://industrial.panasonic.com/sa/system/files/data/download/catalog/id_fixed-resistors_e_2.pdf?src-supplier=Digi-Key; ComponentLink1Description: https://industrial.panasonic.com/sa/system/files/data/download/catalog/id_fixed-resistors_e_2.pdf?src-supplier=Digi-Key; Supplier Part Number 1: P20911CT-ND
R14 = RES_105kΩ_0805: RES SMD 105K OHM 0.1% 1/8W 0805; Manufacturer 1: Panasonic; Manufacturer Part Number 1: ERA-6AEB1053V; Temperature Coefficient: 25ppm/°C; Max Power Dissipation: 125mW; Voltage Rating: 100V; Supplier 1: Digi-Key; RoHS: Yes; Category: Chip SMD Resistors; Stock 1: 6757; Pricing 1: 1=0.34000, 10=0.28800, 100=0.11260, 1000=0.04712, 2500=0.04320 (USD); Mount: Surface Mount; Case/Package: 0805; Number of Pins: 2; Contact Plating: Tin; Case Code (Metric): 2012; Min Operating Temperature: -55°C; Max Operating Temperature: 155°C; Tolerance: 0.1%; Composition: Metal Film,Thin Film; Power Rating: 125mW; Packaging: Tape and Reel; Package Quantity: 5000; Voltage Rating (DC): 100V; Number of Terminations: 2; Termination: Solder; Length: 2mm; Height: 0.5mm; Width: 1.25mm; Depth: 1.25mm; Radiation Hardening: No; Lead Free: Lead Free; ComponentLink1URL: https://datasheet.ciiva.com/11810/0900766b80eb1d8c-11810401.pdf?src-supplier=RSComponents; ComponentLink1Description: https://datasheet.ciiva.com/11810/0900766b80eb1d8c-11810401.pdf?src-supplier=RSComponents; ComponentLink2URL: https://datasheet.ciiva.com/41450/001181353-da-01-en-widerstand-era-0805-105k-0-1-5000st-41450513.pdf?src-supplier=Conrad; ComponentLink2Description: https://datasheet.ciiva.com/41450/001181353-da-01-en-widerstand-era-0805-105k-0-1-5000st-41450513.pdf?src-supplier=Conrad; ComponentLink3URL: https://datasheet.ciiva.com/5950/485442-5950968.pdf?src-supplier=Farnell; ComponentLink3Description: https://datasheet.ciiva.com/5950/485442-5950968.pdf?src-supplier=Farnell; ComponentLink4URL: https://datasheet.ciiva.com/5950/485442-5950970.pdf?src-supplier=Farnell; ComponentLink4Description: https://datasheet.ciiva.com/5950/485442-5950970.pdf?src-supplier=Farnell; ComponentLink5URL: https://datasheet.ciiva.com/17207/aoa0000ce26-17207943.pdf?src-supplier=Avnet+Europe; ComponentLink5Description: https://datasheet.ciiva.com/17207/aoa0000ce26-17207943.pdf?src-supplier=Avnet+Europe; ComponentLink6URL: https://datasheet.ciiva.com/7853/485442-7853533.pdf?src-supplier=Element14; ComponentLink6Description: https://datasheet.ciiva.com/7853/485442-7853533.pdf?src-supplier=Element14; ComponentLink7URL: https://datasheet.ciiva.com/5950/485442-5950967.pdf?src-supplier=Farnell; ComponentLink7Description: https://datasheet.ciiva.com/5950/485442-5950967.pdf?src-supplier=Farnell; ComponentLink8URL: https://datasheet.ciiva.com/5950/485442-5950969.pdf?src-supplier=Farnell; ComponentLink8Description: https://datasheet.ciiva.com/5950/485442-5950969.pdf?src-supplier=Farnell; ComponentLink9URL: https://datasheet.ciiva.com/7853/485442-7853532.pdf?src-supplier=Element14; ComponentLink9Description: https://datasheet.ciiva.com/7853/485442-7853532.pdf?src-supplier=Element14; Supplier Part Number 1: P105KDACT-ND
R15 = RES_100kΩ_0805: RES SMD 100K OHM 0.5% 1/8W 0805; Manufacturer 1: Panasonic; Manufacturer Part Number 1: ERA-6AED104V; Power Rating: 125mW; Temperature Coefficient: 25ppm/°C; Voltage Rating: 200V; Supplier 1: Digi-Key; RoHS: Yes; Category: Chip SMD Resistors; Stock 1: 16167; Pricing 1: 1=0.11000, 10=0.10300, 25=0.07120, 50=0.05540, 100=0.03960, 250=0.03088, 500=0.02456, 1000=0.01742 (USD); Mount: Surface Mount; Case Code (Metric): 2012; Case Code (Imperial): 0805; Contact Plating: Tin; Min Operating Temperature: -55°C; Max Operating Temperature: 155°C; Composition: Thin Film; Termination: SMD/SMT; Military Standard: Not; Packaging: Tape and Reel; Package Quantity: 5000; Length: 2mm; Height: 0.5mm; Depth: 1.25mm; Width: 1.25mm; Lead Free: Lead Free; ComponentLink1URL: https://datasheet.ciiva.com:443/pdfs/VipMasterIC/IC/PANA/PANA-S-A0009459258/PANA-S-A0009459258-1.pdf?src-supplier=IHS+Markit; ComponentLink1Description: https://datasheet.ciiva.com:443/pdfs/VipMasterIC/IC/PANA/PANA-S-A0009459258/PANA-S-A0009459258-1.pdf?src-supplier=IHS+Markit; ComponentLink2URL: https://datasheet.ciiva.com/9186/aoa0000ce26-9186773.pdf?src-supplier=Avnet; ComponentLink2Description: https://datasheet.ciiva.com/9186/aoa0000ce26-9186773.pdf?src-supplier=Avnet; Supplier Part Number 1: P123795CT-ND; Tolerance: 0.5%
R16 = RES_22.1kΩ_0805: RES SMD 22.1K OHM 1% 1/8W 0805; Manufacturer 1: Vishay Dale; Manufacturer Part Number 1: CRCW080522K1FKEA; Power Rating: 125mW; Supplier 1: Digi-Key; Case Code (Metric): 2012; Min Operating Temperature: -55°C; Max Operating Temperature: 155°C; Tolerance: 1%; Termination: SMD/SMT; Supplier Part Number 1: 541-22.1KCCT-ND
U5 = ATL431LIBIDBZR: Three Terminal Voltage Reference, 1 Output, 2.5V, Trim/Adjustable, PDSO3; Manufacturer 1: Texas Instruments; Supplier 1: Digi-Key; RoHS: No; Stock 1: 2706; Pricing 1: 1=0.48000, 10=0.41300, 25=0.38520, 100=0.28600, 250=0.24200, 500=0.23100, 1000=0.17050 (USD); ComponentLink1URL: https://www.ti.com:443/lit/ds/symlink/atl431li.pdf?src-supplier=IHS+Markit; ComponentLink1Description: https://www.ti.com:443/lit/ds/symlink/atl431li.pdf?src-supplier=IHS+Markit; Supplier Part Number 1: 296-53203-1-ND; Manufacturer Part Number 1: ATL431LIBIDBZR
U6 = TPS54202HDDCR: Switching Regulator, Current-mode, 3.9A, 500kHz Switching Freq-Max, PDSO6; Manufacturer 1: Texas Instruments; Output Type: Adjustable; Output Configuration: Positive; Number of Outputs: 1; Min Input Voltage: 4.5V; Max Input Voltage: 28V; Min Output Voltage: 596mV; Output Current: 2A; Synchronous Rectifier: Yes; Quiescent Current: 40uA; Supplier 1: Digi-Key; RoHS: No; Category: Voltage Regulators - Switching; Stock 1: 8470; Pricing 1: 1=1.45000, 10=1.29800, 25=1.23200, 100=0.94600, 250=0.83600, 500=0.79200, 1000=0.61600 (USD); Mount: Surface Mount; Case/Package: SOT-23-6; Min Operating Temperature: -40°C; Max Operating Temperature: 125°C; Packaging: Tape and Reel; Max Output Voltage: 28V; Switching Frequency: 500kHz; Lead Free: Lead Free; ComponentLink1URL: https://www.ti.com:443/lit/ds/symlink/tps54202h.pdf?src-supplier=IHS+Markit; ComponentLink1Description: https://www.ti.com:443/lit/ds/symlink/tps54202h.pdf?src-supplier=IHS+Markit; ComponentLink2URL: http://www.ti.com/lit/ds/symlink/tps54202h.pdf?src-supplier=Digi-Key; ComponentLink2Description: http://www.ti.com/lit/ds/symlink/tps54202h.pdf?src-supplier=Digi-Key; Supplier Part Number 1: 296-44396-1-ND; Manufacturer Part Number 1: TPS54202HDDCR
TP12-TP16 = TESTPOINT_SMD: Part Number (MPN): *

## Nets that join several sheets
17V: H-bridge and gate drivers (7 pins), Connectors and PDB (R12.2 R13.2 TP13.1 U5.1)
24V: H-bridge and gate drivers (7 pins), Connectors and PDB (11 pins)
GND: H-bridge and gate drivers (20 pins), Connectors and PDB (16 pins)
MOTOR_M: H-bridge and gate drivers (10 pins), Connectors and PDB (J3.2)
MOTOR_P: H-bridge and gate drivers (10 pins), Connectors and PDB (J3.1)